# EAGLE design M_D_ext_power-solar-moved-usb (EAGLE 9.6.2)
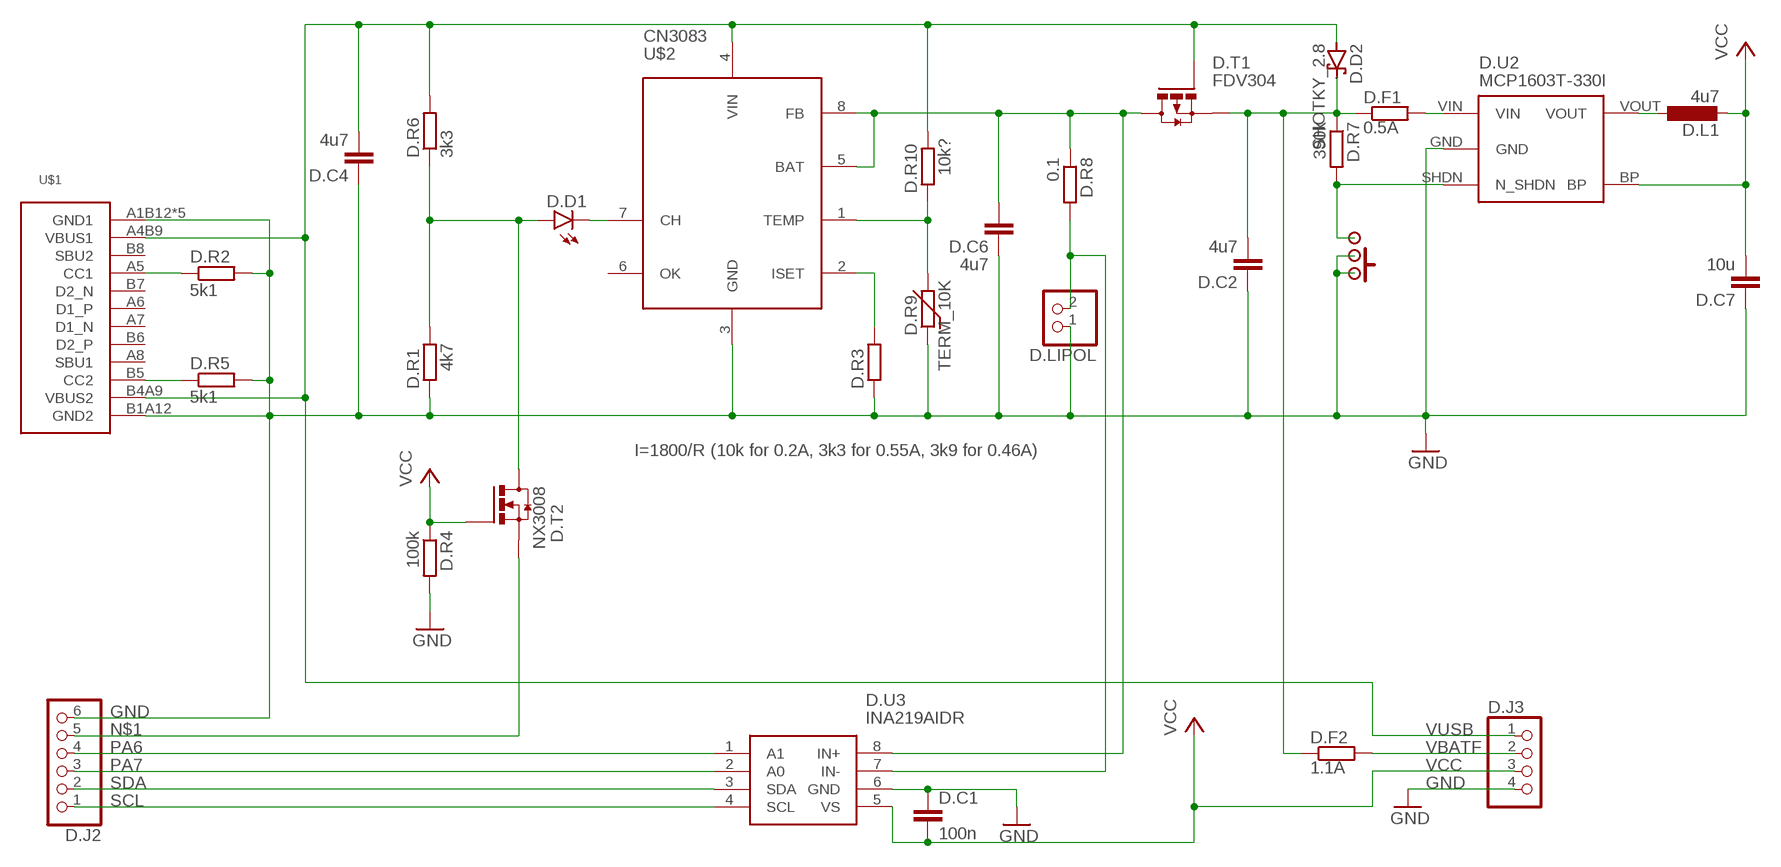
[diagram p0: schematic, sheet 1]

## Parts
D.C1  100n  C-EUC0603  [C0603]
D.C2  4u7  C-EUC0603  [C0603]
D.C4  4u7  C-EUC0603  [C0603]
D.C6  4u7  C-EUC0603  [C0603]
D.C7  10u  C-EUC0805  [C0805]
D.D1  LEDCHIP-LED0603  [CHIP-LED0603]
D.D2  SHOTKY_2.8  [SHOTKY_2.8]
D.F1  0.5A  R-EU_R0805  [R0805]
D.F2  1.1A  R-EU_R0805  [R0805]
D.J2  PINHD-1X6  [1X06]
D.J3  PINHD-1X4  [1X04]
D.L1  4u7  L-EUL3230M  [L3230M]
D.LIPOL  PINHD-1X2  [1X02]
D.ON/OFF/RESET  SWITCH  [SWITCH]
D.R1  4k7  R-EU_R0603  [R0603]
D.R2  5k1  R-EU_R0603  [R0603]
D.R3  I=1800/R (10k for 0.2A, 3k3 for 0.55A, 3k9 for 0.46A)  R-EU_R0603  [R0603]
D.R4  100k  R-EU_R0603  [R0603]
D.R5  5k1  R-EU_R0603  [R0603]
D.R6  3k3  R-EU_R0603  [R0603]
D.R7  390k  R-EU_R0603  [R0603]
D.R8  0.1  R-EU_R0805  [R0805]
D.R9  TERM_10K  THERM  [THERM]
D.R10  10k?  R-EU_R0603  [R0603]
D.T1  FDV304  P-MOSFET  [SO23]
D.T2  NX3008  N-MOSFET  [SO23]
D.U2  MCP1603T-330I  STABILISER_APE8865  [SOT32-5]
D.U3  INA219AIDR  [SOIC127P600X175-8N]
U$1  USB-C  [USB-C]
U$2  CN3083  [SOP8]

## Nets
GND: D.C1.1 D.C2.1 D.C4.1 D.C6.1 D.C7.1 D.J2.6 D.J3.4 D.LIPOL.1 D.ON/OFF/RESET.P$1 D.ON/OFF/RESET.P$2 D.ON/OFF/RESET.P$4 D.R1.1 D.R2.2 D.R3.1 D.R4.2 D.R5.2 D.R9.1 D.U2.GND D.U3.6(GND) U$1.A1B12(GND1) U$1.B1A12(GND2) U$1.SH1(GND1) U$1.SH2(GND1) U$1.SH3(GND1) U$1.SH4(GND1) U$2.3(GND)
IN+: D.LIPOL.2 D.R8.2 D.U3.7(IN-)
IN-: D.C6.2 D.R8.1 D.T1.D D.U3.8(IN+) U$2.5(BAT) U$2.8(FB)
N$1: D.J2.5 D.T2.S
N$2: D.L1.1 D.U2.VOUT
N$3: D.D1.C1(C) U$2.7(CH)
N$4: D.R5.1 U$1.B5(CC2)
N$5: D.ON/OFF/RESET.P$3 D.ON/OFF/RESET.P$5 D.R7.2 D.U2.SHDN(N_SHDN)
N$6: D.R2.1 U$1.A5(CC1)
N$7: D.R3.2 U$2.2(ISET)
N$8: D.R9.2 D.R10.1 U$2.1(TEMP)
N$9: D.F1.2 D.U2.VIN
PA3: D.D1.A1(A) D.R1.2 D.R6.1 D.T2.D
PA6: D.J2.4 D.U3.1(A1)
PA7: D.J2.3 D.U3.2(A0)
SCL: D.J2.1 D.U3.4(SCL)
SDA: D.J2.2 D.U3.3(SDA)
VBATF: D.F2.2 D.J3.2
VCC: D.C1.2 D.C7.2 D.J3.3 D.L1.2 D.R4.1 D.T2.G D.U2.BP D.U3.5(VS)
VMOT: D.C2.2 D.D2.K(C) D.F1.1 D.F2.1 D.R7.1 D.T1.S
VUSB: D.C4.2 D.D2.A D.J3.1 D.R6.2 D.R10.2 D.T1.G U$1.A4B9(VBUS1) U$1.B4A9(VBUS2) U$2.4(VIN)
Unconnected: U$1.A6(D1_P) U$1.A7(D1_N) U$1.A8(SBU1) U$1.B6(D2_P) U$1.B7(D2_N) U$1.B8(SBU2) U$2.6(OK)

## Library data of the parts
D.C1 D.C2 D.C4 D.C6 D.C7 = rcl:C-EU: CAPACITOR, European symbol; SPICEPREFIX: C
D.D1 = led:LED: LED OSRAM: - CHIPLED LG R971, LG N971, LY N971, LG Q971, LY Q971, LO R971, LY R971 LH N974, LH R974 LS Q976, LO Q976, LY Q976 LO Q996 - Hyper CHIPLED LW Q18S LB Q993, LB Q99A, LB R99A - SideLED LS A670, LO A670, LY A670, LG A670, LP A670 LB A673, LV A673, LT A673, LW A673 LH A674 LY A675 LS A676, LA A676, LO A676, LY A676, LW A676 LS A679, LY A679, LG A679 - Hyper Micro SIDELED® LS Y876, LA Y876, LO Y876, LY Y876 LT Y87S - SmartLED LW L88C, LW L88S LB L89C, LB L89S, LG L890 LS L89K, LO L89K, LY L89K LS L896, LA L896, LO L896, LY L896 - TOPLED LS T670, LO T670, LY T670, LG T670, LP T670 LSG T670, LSP T670, LSY T670, LOP T670, LYG T670 LG T671, LOG T671, LSG T671 LB T673, LV T673, LT T673, LW T673 LH T674 LS T676, LA T676, LO T676, LY T676, LB T676, LH T676, LSB T676, LW T676 LB T67C, LV T67C, LT T67C, LS T67K, LO T67K, LY T67K, LW E67C LS E67B, LA E67B, LO E67B, LY E67B, LB E67C, LV E67C, LT E67C LW T67C LS T679, LY T679, LG T679 LS T770, LO T770, LY T770, LG T770, LP T770 LB T773, LV T773, LT T773, LW T773 LH T774 LS E675, LA E675, LY E675, LS T675 LS T776, LA T776, LO T776, LY T776, LB T776 LHGB T686 LT T68C, LB T68C - Hyper Mini TOPLED® LB M676 - Mini TOPLED Santana® LG M470 LS M47K, LO M47K, LY M47K Source: http://www.osram.convergy.de LUXEON: - LUMILED® LXK2-PW12-R00, LXK2-PW12-S00, LXK2-PW14-U00, LXK2-PW14-V00 LXK2-PM12-R00, LXK2-PM12-S00, LXK2-PM14-U00 LXK2-PE12-Q00, LXK2-PE12-R00, LXK2-PE12-S00, LXK2-PE14-T00, LXK2-PE14-U00 LXK2-PB12-K00, LXK2-PB12-L00, LXK2-PB12-M00, LXK2-PB14-N00, LXK2-PB14-P00, LXK2-PB14-Q00 LXK2-PR12-L00, LXK2-PR12-M00, LXK2-PR14-Q00, LXK2-PR14-R00 LXK2-PD12-Q00, LXK2-PD12-R00, LXK2-PD12-S00 LXK2-PH12-R00, LXK2-PH12-S00 LXK2-PL12-P00, LXK2-PL12-Q00, LXK2-PL12-R00 Source: www.luxeon.com KINGBRIGHT: KA-3528ASYC Source: www.kingbright.com
D.D2 = hugo:SHOTKY_2.8
D.F1 D.F2 D.R1-D.R8 D.R10 = rcl:R-EU_: RESISTOR, European symbol; SPICEPREFIX: R
D.J2 = pinhead2:PINHD-1X6: PIN HEADER
D.J3 = pinhead2:PINHD-1X4: PIN HEADER
D.L1 = rcl:L-EU: INDUCTOR, European symbol; SPICEPREFIX: L
D.LIPOL = pinhead2:PINHD-1X2: PIN HEADER
D.ON/OFF/RESET = hugo:SWITCH
D.R9 = hugo:THERM
D.T1 = hugo:P-MOSFET
D.T2 = hugo:N-MOSFET
D.U2 = !stavebnice03:STABILISER_APE8865
D.U3 = SamacSys_Parts:INA219AIDR: 26-V, Bidirectional, Zero-Drift, High-Side, I2C Out Current/Power Monitor Source: Datasheet <http://www.ti.com/lit/gpn/ina219>; DESCRIPTION: 26-V, Bidirectional, Zero-Drift, High-Side, I2C Out Current/Power Monitor; HEIGHT: 1.75mm; MANUFACTURER_NAME: Texas Instruments; MANUFACTURER_PART_NUMBER: INA219AIDR; MOUSER_PART_NUMBER: 595-INA219AIDR; MOUSER_PRICE-STOCK: https://www.mouser.co.uk/ProductDetail/Texas-Instruments/INA219AIDR?qs=XGzIaZb%2FFYIE5YcOHTnKDA%3D%3D
U$1 = hugo:USB-C
U$2 = hugo:CN3083

## Board
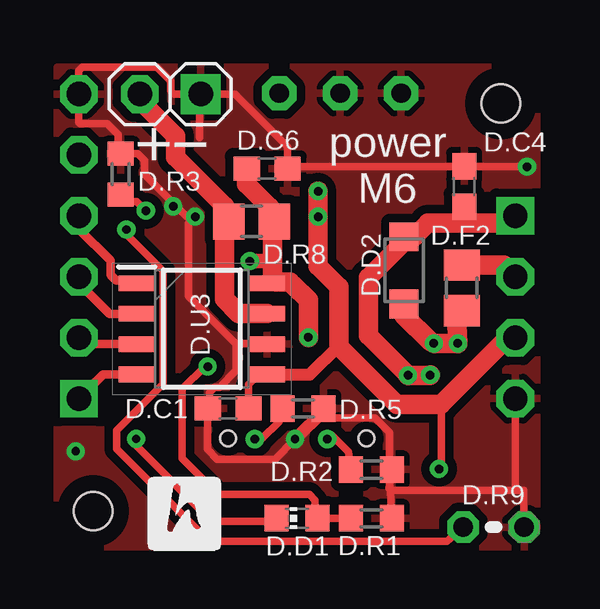
[diagram p1: board, top side]
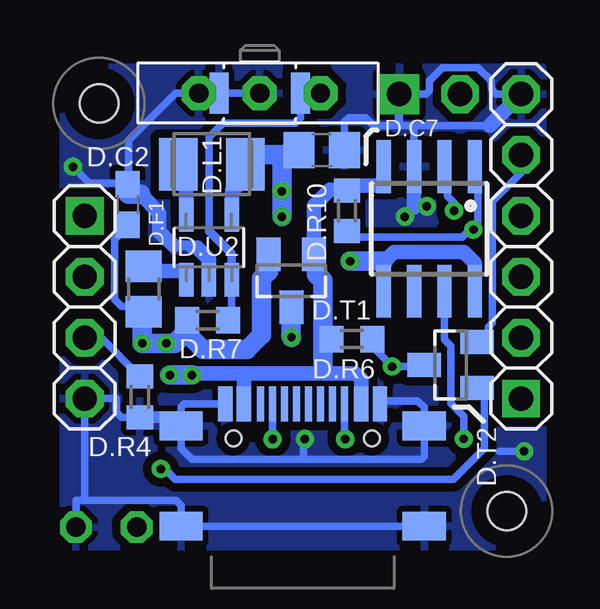
[diagram p2: board, bottom side, seen from below]

No outline drawn. Coordinates in mm, seen from the top.
Copper layers (1*16): Top 0.035mm / dielectric 1.5mm / Bottom 0.035mm
Design rules "default *": minimum track width 10mil, minimum drill 0.35mm, track to track 6mil, track to pad 6mil, pad to pad 6mil, via to via 10mil, smd to smd 10mil, copper to edge 15mil, drill to drill 15mil, minimum pad ring 10mil, minimum via ring 8mil, stop-mask expansion 4mil, vias tented up to drill 14mil, thermal gap 10mil
Holes 1.6 mm at 2,2 19,19
tRestrict: area 18,18 to 20,20; area 1,1 to 3,3
bRestrict: area 1,1 to 3,3; area 18,18 to 20,20

### Footprints (pad centres in the part's own frame; a part is rotated, then mirrored left to right if it is on the bottom)
C0603 = smd 1.1 x 1: 1 -0.85,0; 2 0.85,0
C0805 = smd 1.3 x 1.5: 1 -0.95,0; 2 0.95,0
CHIP-LED0603 = smd 1.1 x 1: A1 0,-0.85; C1 0,0.85
SHOTKY_2.8 = smd 1.2 x 1.2: A -1.4,0; K 1.4,0
R0805 = smd 1.3 x 1.5: 1 -0.95,0; 2 0.95,0
1X06 = drill 1.016 pad 1.575 square: 1 -6.35,0 | drill 1.016 pad 1.575 octagon: 2 -3.81,0; 3 -1.27,0; 4 1.27,0; 5 3.81,0; 6 6.35,0
1X04 = drill 1.016 pad 1.575 square: 1 -3.81,0 | drill 1.016 pad 1.575 octagon: 2 -1.27,0; 3 1.27,0; 4 3.81,0
L3230M = smd 1.6 x 2.2: 1 -1.4,0; 2 1.4,0
1X02 = drill 1.016 pad 1.676 square: 1 -1.27,0 | drill 1.016 pad 1.575 octagon: 2 1.27,0
SWITCH = drill 0.8 pad 1.422 octagon: P$1 -2.54,0; P$2 0,0; P$3 2.54,0 | smd 0.8 x 1.7: P$4 -1.7,0; P$5 1.7,0
R0603 = smd 1 x 1.1: 1 -0.85,0; 2 0.85,0
THERM = drill 0.813 octagon: 1 -1.27,0; 2 1.27,0
SO23 = smd 1 x 1.4: D 0,1.1; G -0.95,-1.1; S 0.95,-1.1
SOT32-5 = smd 0.6 x 1.4: BP 0.95,1.35; GND 0,-1.35; SHDN 0.95,-1.35; VIN -0.95,-1.35; VOUT -0.95,1.35
SOIC127P600X175-8N = smd 1.528 x 0.65: 1 -2.711,1.905; 2 -2.711,0.635; 3 -2.711,-0.635; 4 -2.711,-1.905; 5 2.711,-1.905; 6 2.711,-0.635; 7 2.711,0.635; 8 2.711,1.905
USB-C = smd 0.6 x 1.45: A1B12 -3.235,3.825; A4B9 -2.46,3.825; B1A12 3.215,3.825; B4A9 2.44,3.825 | smd 0.3 x 1.45: A5 -1.26,3.825; A6 -0.26,3.825; A7 0.24,3.825; A8 1.24,3.825; B5 1.74,3.825; B6 0.74,3.825; B7 -0.76,3.825; B8 -1.76,3.825 | smd 1.8 x 1.2: SH1 -5.08,2.91; SH2 -5.08,-1.27; SH3 5.06,-1.27; SH4 5.06,2.91 | hole 0.65: 2.88,2.38; -2.9,2.38
SOP8 = smd 0.6 x 2.2: 1 -1.905,-2.6; 2 -0.635,-2.6; 3 0.635,-2.6; 4 1.905,-2.6; 5 1.905,2.6; 6 0.635,2.6; 7 -0.635,2.6; 8 -1.905,2.6

### Placement (x,y rotation side)
D.C1  7.63,6.28 0 top
D.C2  17.81,14.78 270 bottom
D.C4  17.47,15.53 270 top
D.C6  9.25,16.29 180 top
D.C7  9.72,17.05 180 bottom
D.D1  10.5,1.7 90 top
D.D2  14.96,12.04 270 top
D.F1  17.13,11.26 90 bottom
D.F2  17.36,11.31 90 top
D.J2  1.4,13.04 90 bottom
D.J3  19.6,10.5 270 bottom
D.L1  14.3,16.46 0 bottom
D.LIPOL  5.21,19.39 180 top
D.ON/OFF/RESET  12.3,19.42 0 bottom
D.R1  13.6,1.7 180 top
D.R2  13.6,3.73 0 top
D.R3  3.14,16.06 270 top
D.R4  17.3,6.76 270 bottom
D.R5  10.74,6.28 0 top
D.R6  8.46,9.17 180 bottom
D.R7  14.47,9.96 0 bottom
D.R8  8.6,14.08 180 top
D.R9  18.7,1.33 180 top
D.R10  8.66,14.52 90 bottom
D.T1  10.98,11.61 180 bottom
D.T2  4.34,8.09 90 bottom
D.U2  14.41,13 0 bottom
D.U3  6.53,9.6 0 top
U$1  10.5,2.64 0 bottom
U$2  5.23,13.77 180 bottom

### Tracks (layer width: path | path; a pad name or v marks a point on that pad's centre or on a via)
GND  (via drill 0.35)
  Top 0.305: D.R3.1 3.04,17.01 3.04,17.69 2.57,18.16 1.45,18.16 1.4,18.21 D.J2.6 1.4,20.37 1.53,20.51 4.67,20.51 5.23,19.95 5.23,19.53 5.38,19.39 D.LIPOL.1 7.91,19.39 10.1,17.2 D.C6.1 10.17,16.36 v20.09,16.36 17.49,16.36 D.C4.1 | D.R3.1 3.37,16.68 | D.U3.6 9.21,8.99 7.96,8.99 7.96,7.86 7.27,7.17 7.06,7.17 6.85,6.96 6.85,6.35 D.C1.1 6.78,5.39 6.76,5.38 6.76,4.57 7.17,4.16 9.58,4.16 v10.41,5 10.44,5 | 7.94,8.99 5.98,10.95 5.98,14.01 v6.25,14.28 5.89,14.28 4.14,16.03 4.14,16.61 3.85,16.91 D.R3.1 | 6.43,18.75 6.43,17.57 | 19.6,5.65 D.J3.4 19.6,2.87 | 14.37,1.81 D.R1.1 14.35,3.58 | 19.6,2.87 19.95,2.87 19.95,1.34 D.R9.1 | 19.6,2.87 14.41,2.87 14.34,2.95 D.R2.2 14.34,3.78 14.35,3.58 | 14.35,3.58 14.35,5.29 13.76,5.88 12,5.88 D.R5.2 11.59,6.16
  Top 0.508: 11.59,6.16 10.44,5
  Bottom 0.305: D.LIPOL.1 6.48,18.08 | 6.51,18.19 6.51,19.36 D.LIPOL.1 | 17.77,15.82 17.77,17.46 15.81,19.42 D.ON/OFF/RESET.P$1 | 2.71,18.08 5.87,18.08 | 5.87,18.08 6.48,18.08 | D.ON/OFF/RESET.P$1 D.ON/OFF/RESET.P$2 | D.ON/OFF/RESET.P$4 D.ON/OFF/RESET.P$1 | v20.09,16.36 19.41,15.67 17.82,15.67 D.C2.1 17.78,15.21 | U$2.3 5.87,18.08 | v6.25,14.28 5.87,14.66 | U$1.B1A12 7.16,6.59 5.72,6.59 5.44,6.31 U$1.SH4 | U$1.A1B12 15.45,6.47 15.58,6.34 U$1.SH1 | D.R9.1 19.96,1.34 19.96,2.44 19.6,2.44 | 19.6,2.44 D.J3.4 18.28,6.69 18.28,6.14 18.05,5.91 D.R4.2 | 5.44,1.6 U$1.SH3 U$1.SH2 15.58,2.23 15.78,2.44 19.6,2.44 | U$1.SH1 15.94,5.91 | U$1.SH4 5.88,5.55 | 10.46,4.16 5.57,4.16 5.44,4.29 U$1.SH4 | 10.46,4.16 15.12,4.16 15.58,4.62 U$1.SH1 | v10.41,5 10.46,4.95 10.46,4.16 | v1.27,4.5 2.32,4.5 | 8.59,17.05 D.C7.1 8.77,18.23 8.59,18.41 7.9,18.41 7.56,18.08 6.48,18.08 | D.LIPOL.1 5.38,19.39 5.23,19.53 5.23,19.95 4.68,20.5 3.2,20.5 2.64,19.94 2.64,19.61 2.42,19.39 D.J2.6
  Bottom 0.406: 15.14,12.99 15.21,13.06 15.89,13.06
  Bottom 0.508: 14.91,12.99 15.14,12.99 | 15.94,5.91 D.R4.2
  Bottom 0.61: D.U2.GND 14.41,12.49 14.91,12.99 | 8.59,17.05 8.79,17.26 | D.J2.6 2.71,18.08 | 5.87,14.66 U$2.3 | 15.89,13.06 16.48,13.65 16.48,14.43 17.27,15.21
  Bottom 0.813: 17.78,15.21 17.27,15.21
  other vias: 5.33,14.71
  pour Top (isolate 0.356): 0.5,20.5 0.5,0.5 20.5,0.5 20.5,20.5
  pour Bottom (isolate 0.356, rank 3): 0.5,20.5 20.5,20.5 20.5,0.5 0.5,0.5
  pour Bottom: 7.85,14.96 4.98,14.96 4.98,13.87 7.85,13.87
IN+
  Top 0.813: D.LIPOL.2 3.94,19.14 5.44,17.64 5.44,16.76 7.47,14.73 7.47,14.25 D.R8.2 7.47,13.89 7.47,10.84 8.07,10.24 D.U3.7
IN-  (via drill 0.35)
  Top 0.305: 10.34,11.43 10.21,11.56 | 9.83,11.56 9.63,11.56 | 9.55,11.63 9.37,11.63 D.U3.8 9.39,11.66 9.39,12.42
  Top 0.61: v8.53,12.42 9.39,12.42
  Top 0.813: D.R8.1 9.35,14.28 9.35,14.68 8.4,15.63 D.C6.2 | D.R8.1 9.64,14.08 | v10.97,9.25 10.97,10.79 10.34,11.43 | D.R8.1 9.47,14 9.47,11.71 9.55,11.63 9.63,11.56 | 10.21,11.56 9.83,11.56
  Bottom 0.305: U$2.5 7.14,12.42
  Bottom 0.61: 7.14,11.76 U$2.5 7.14,12.37 6.71,12.8 3.79,12.8 3.33,12.34 U$2.8
  Bottom 0.813: D.T1.D 11,10.49 11,9.27 v10.97,9.25 | 7.14,12.42 v8.53,12.42
N$1
  Bottom 0.305: D.J2.5 1.4,16.11 2.59,14.91 2.59,9.85 2.76,9.68 2.76,9.37 3.09,9.04 D.T2.S
N$2
  Bottom 0.61: D.U2.VOUT 15.36,15.54 15.7,15.87 D.L1.1
N$3  (via drill 0.35)
  Top 0.305: 9.79,1.97 D.D1.C1 9.47,1.58 6.94,1.58 3.79,4.73 v3.79,5.01
  Bottom 0.305: 4.62,11.14 U$2.7 4.6,9.15 4.34,8.89 4.34,6.5 3.79,5.95 v3.79,5.01
N$4  (via drill 0.35)
  Top 0.305: D.R5.1 9.74,6.13 9.74,5.73 9.01,5 v8.73,5
  Bottom 0.305: U$1.B5 8.76,5.2 v8.73,5
N$5
  Bottom 0.305: 14.4,13.67 14.4,17.59 13.83,18.17 10.81,18.17 10.6,18.38 D.ON/OFF/RESET.P$5 D.ON/OFF/RESET.P$3 | D.U2.SHDN 13.46,10.11 D.R7.2
  Bottom 0.356: 13.45,11.63 D.U2.SHDN 13.46,12.73 14.4,13.67 | 13.45,10.13 D.R7.2
N$6  (via drill 0.35)
  Top 0.305: v11.76,5 11.95,5.16 12.64,4.47 D.R2.1
  Bottom 0.305: U$1.A5 v11.76,5
N$7  (via drill 0.35)
  Top 0.305: 3.27,15.21 D.R3.2 3.45,14.9 3.82,14.9 v4.2,14.53
  Bottom 0.305: U$2.2 4.47,16.24 4.47,15.13 4.2,14.86 v4.2,14.53
N$8  (via drill 0.35)
  Top 0.305: v3.38,13.73 v3.38,13.74 3.38,13.54 4.91,12.01 4.91,7.3 2.97,5.36 2.97,4.6 6.83,0.74 16.76,0.74 D.R9.2
  Bottom 0.305: v3.38,13.74 3.38,13.89 | U$2.1 3.2,16.24 3.2,14.08 3.38,13.89 | 3.38,13.89 3.84,13.44 8.43,13.44 D.R10.1 8.52,13.56
N$9
  Bottom 0.305: D.U2.VIN 15.36,11.88 15.49,12.01 | 16.93,12.01 D.F1.2
  Bottom 0.61: 16.93,12.01 15.49,12.01
  Bottom 0.813: D.F1.2 16.98,12.21
PA3  (via drill 0.35)
  Top 0.305: 12.65,1.78 D.R1.2 D.D1.A1 11.25,1.88 11.25,2.46 11.02,2.69 7.21,2.69 5.71,4.19 5.71,7.09 6.66,8.03 v6.77,8.03
  Bottom 0.305: 7.61,9.05 D.R6.1 7.61,8.86 v6.77,8.03 5.44,8.03 5.41,8.06 | D.T2.D 5.41,8.06 | 5.41,8.06 5.32,8.15
PA6
  Top 0.356: D.U3.1 3.71,11.61 2.96,11.61 2.72,11.85 2.72,12.45 1.4,13.77 D.J2.4
PA7
  Top 0.305: D.J2.3 1.4,11.51
  Top 0.356: 1.4,11.51 2.69,10.22 3.8,10.22 D.U3.2
SCL
  Top 0.356: D.U3.4 2.41,7.7 D.J2.1
SDA
  Top 0.305: 3.81,8.98 D.U3.3
  Top 0.356: D.U3.3 1.9,8.97 1.78,8.85 D.J2.2
VBATF
  Top 0.813: D.J3.2 19.12,12.25 D.F2.2
VCC  (via drill 0.35)
  Top 0.305: 9.39,7.85 D.U3.5 9.06,7.87 8.48,7.29 D.C1.2 | v16.42,3.76 16.52,3.86 16.52,6.25 16.33,6.45
  Top 0.508: D.U3.5 11.03,7.7 12.24,8.91
  Top 0.61: 9.26,7.72 D.U3.5
  Top 0.813: v11.38,15.34 v11.38,14.28 11.38,12.22 12.24,11.35 12.24,8.91 12.24,8.86 14.66,6.45 16.33,6.45 16.51,6.45 19.29,9.23 D.J3.3
  Bottom 0.305: D.R4.1 18.92,9.23 D.J3.3 | D.T2.G 2.94,6.84 2.94,4.61 4.22,3.33 15.82,3.33 16.25,3.76 v16.42,3.76
  Bottom 0.356: v11.38,14.26 v11.38,14.28
  Bottom 0.61: D.L1.2 12.9,15.91 13.46,15.35 D.U2.BP | 12.43,16.93 D.L1.2 | D.C7.2 10.74,16.98 11.99,16.98 11.89,16.87 | D.L1.2 12.49,16.87 | 11.38,16.57 11.68,16.87
  Bottom 0.813: 11.68,16.87 11.89,16.87 12.49,16.87 | 11.38,14.33 | v11.38,14.28 11.38,14.33 | 11.38,14.33 11.38,16.57
VMOT  (via drill 0.35)
  Top 0.813: 17.2,9.9 17.2,10.19 D.F2.1 17.37,10.36 | v16.2,8.99 16.05,9.06 14.96,10.16 D.D2.K | v16.2,8.99 v16.21,8.99 | 17.41,10.39 17.37,10.36 | 17.37,10.36 17.15,10.13 v17.2,8.99 v16.2,8.99
  Bottom 0.305: D.C2.2 17.78,13.89 18.34,13.33 18.34,10.83 18.05,10.54 17.36,10.54 D.F1.1 | 15.32,9.53 D.R7.1
  Bottom 0.813: D.T1.S 11.93,11.99 12.23,11.69 12.23,9.34 12.84,8.73 14.66,8.73 15.32,9.4 D.R7.1 | D.F1.1 17.21,10.23 v17.21,8.99 v16.2,8.99 15.85,8.99 15.32,9.53
VUSB  (via drill 0.35)
  Top 0.305: D.C4.2 17.48,14.01
  Top 0.813: D.J3.1 19.3,14.01 17.48,14.01 15.96,14.01 15.39,13.44 D.D2.A 14.96,13.21 13.49,11.74 13.49,9.32 15.13,7.68 v15.13,7.66 v16.04,7.66 v16.05,7.67
  Bottom 0.305: 9.34,9.26 9.34,9.21 D.R6.2 | D.R6.2 9.52,9.17 | 12.81,7.51 12.96,7.36 12.96,7.73 12.95,7.74 | D.R6.2 9.54,8.94 9.66,8.82 9.67,8.82 9.79,8.82
  Bottom 0.61: 10.03,12.83 D.T1.G 10.03,14.73 9.36,15.4 D.R10.2 8.46,15.57 7.35,15.57 7.14,15.78 U$2.4 | U$1.A4B9 12.96,7.36 | 9.67,7.94 9.87,7.74 12.95,7.74 15.1,7.74 15.13,7.71 v15.13,7.66 15.13,7.67 | 9.67,7.84 9.58,7.75 8.31,7.75 8.06,7.5 U$1.B4A9
  Bottom 0.813: D.T1.G 9.93,12.6 9.93,11.87 9.67,11.61 9.67,8.82 9.64,8.8 | 9.32,9.23 9.34,9.26 | v16.05,7.67 15.13,7.67 | 9.67,7.84 9.67,7.94 9.67,8.81 9.54,8.94

### Text on the board
tPlace: + | − | power / M6